# EAGLE schematic Final Project Designs (EAGLE 7.6.0)
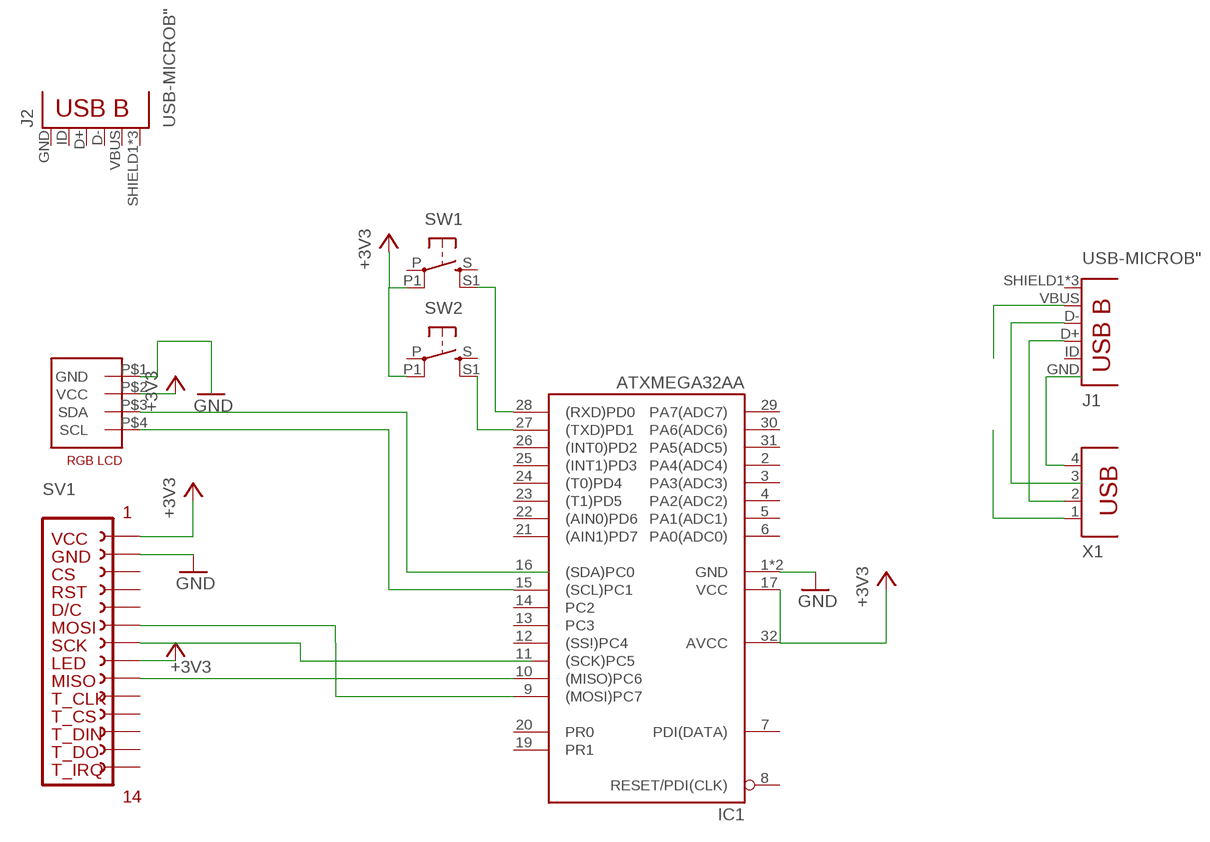
[diagram p0: schematic, sheet 1]

## Parts
IC1  ATXMEGA32AA  [TQFP32-08]
J1  USB-MICROB"  [USB-B-MICRO-SMD_V03]
J2  USB-MICROB"  [USB-B-MICRO-SMD_V03]
SV1  14_PIN_FEMALE_HEADER  [FE15]
SW1  10-XX-4.5SMD  [BT4.5X4.5]
SW2  10-XX-4.5SMD  [BT4.5X4.5]
U$1  4PIN_GROVE_CONNECTORUNIVERSAL_4_PIN_CONNECTOR  [RGB_LCD]
X1  PN87520  [PN87520]

## Nets
+3V3: IC1.17(VCC) IC1.32(AVCC) SV1.P$7(LED) SV1.P$14(VCC) SW1.P1 SW2.P1 U$1.P$2(VCC)
GND: IC1.1(GND) IC1.18(GND) SV1.P$13(GND)
N$1: IC1.9((MOSI)PC7) SV1.P$9(MOSI)
N$2: SV1.P$8(SCK)
N$3: IC1.10((MISO)PC6) SV1.P$6(MISO)
N$4: IC1.15((SCL)PC1) U$1.P$4(SCL)
N$5: U$1.P$3(SDA)
N$6: X1.4
N$7: J1.D+ X1.2
N$8: J1.D-
N$9: IC1.27((TXD)PD1) SW2.S1
N$10: IC1.28((RXD)PD0) SW1.S1
N$11: U$1.P$1(GND)
N$12: J1.VBUS
N$13: X1.1
Unconnected: IC1.2(PA4(ADC4)) IC1.3(PA3(ADC3)) IC1.4(PA2(ADC2)) IC1.5(PA1(ADC1)) IC1.6(PA0(ADC0)) IC1.7(PDI(DATA)) IC1.8(RESET/PDI(CLK)) IC1.11((SCK)PC5) IC1.12((SS!)PC4) IC1.13(PC3) IC1.14(PC2) IC1.16((SDA)PC0) IC1.19(PR1) IC1.20(PR0) IC1.21((AIN1)PD7) IC1.22((AIN0)PD6) IC1.23((T1)PD5) IC1.24((T0)PD4) IC1.25((INT1)PD3) IC1.26((INT0)PD2) IC1.29(PA7(ADC7)) IC1.30(PA6(ADC6)) IC1.31(PA5(ADC5)) J1.GND J1.ID(USBID) J1.SHIELD1(SHIELD) J1.SHIELD2(SHIELD) J1.SHIELD3(SHIELD) J2.D+ J2.D- J2.GND J2.ID(USBID) J2.SHIELD1(SHIELD) J2.SHIELD2(SHIELD) J2.SHIELD3(SHIELD) J2.VBUS SV1.P$1(T_IRQ) SV1.P$2(T_DO) SV1.P$3(T_DIN) SV1.P$4(T_CS) SV1.P$5(T_CLK) SV1.P$10(D/C) SV1.P$11(RESET) SV1.P$12(CS) SW1.P SW1.S SW2.P SW2.S X1.3

## Library data of the parts
IC1 = Tft_lcd_header:ATXMEGA32A: MICROCONTROLLER 2 Kbytes FLASH 128 bytes SRAM 128 bytes EEPROM UART 6-channel 10-bit ADC; OC_FARNELL: unknown; OC_NEWARK: unknown
J1 J2 = SparkFun-Connectors:USB-MICROB; PROD_ID: CONN-11752
SV1 = Tft_lcd_header:14_PIN_FEMALE_HEADER: FEMALE HEADER; OC_FARNELL: unknown; OC_NEWARK: unknown
SW1 SW2 = buttons:10-XX: OMRON SWITCH
U$1 = Tft_lcd_header:4PIN_GROVE_CONNECTOR
X1 = con-berg:PN87520: BERG USB connector; OC_FARNELL: unknown; OC_NEWARK: unknown